# EAGLE design millionOhms (EAGLE 6.1)
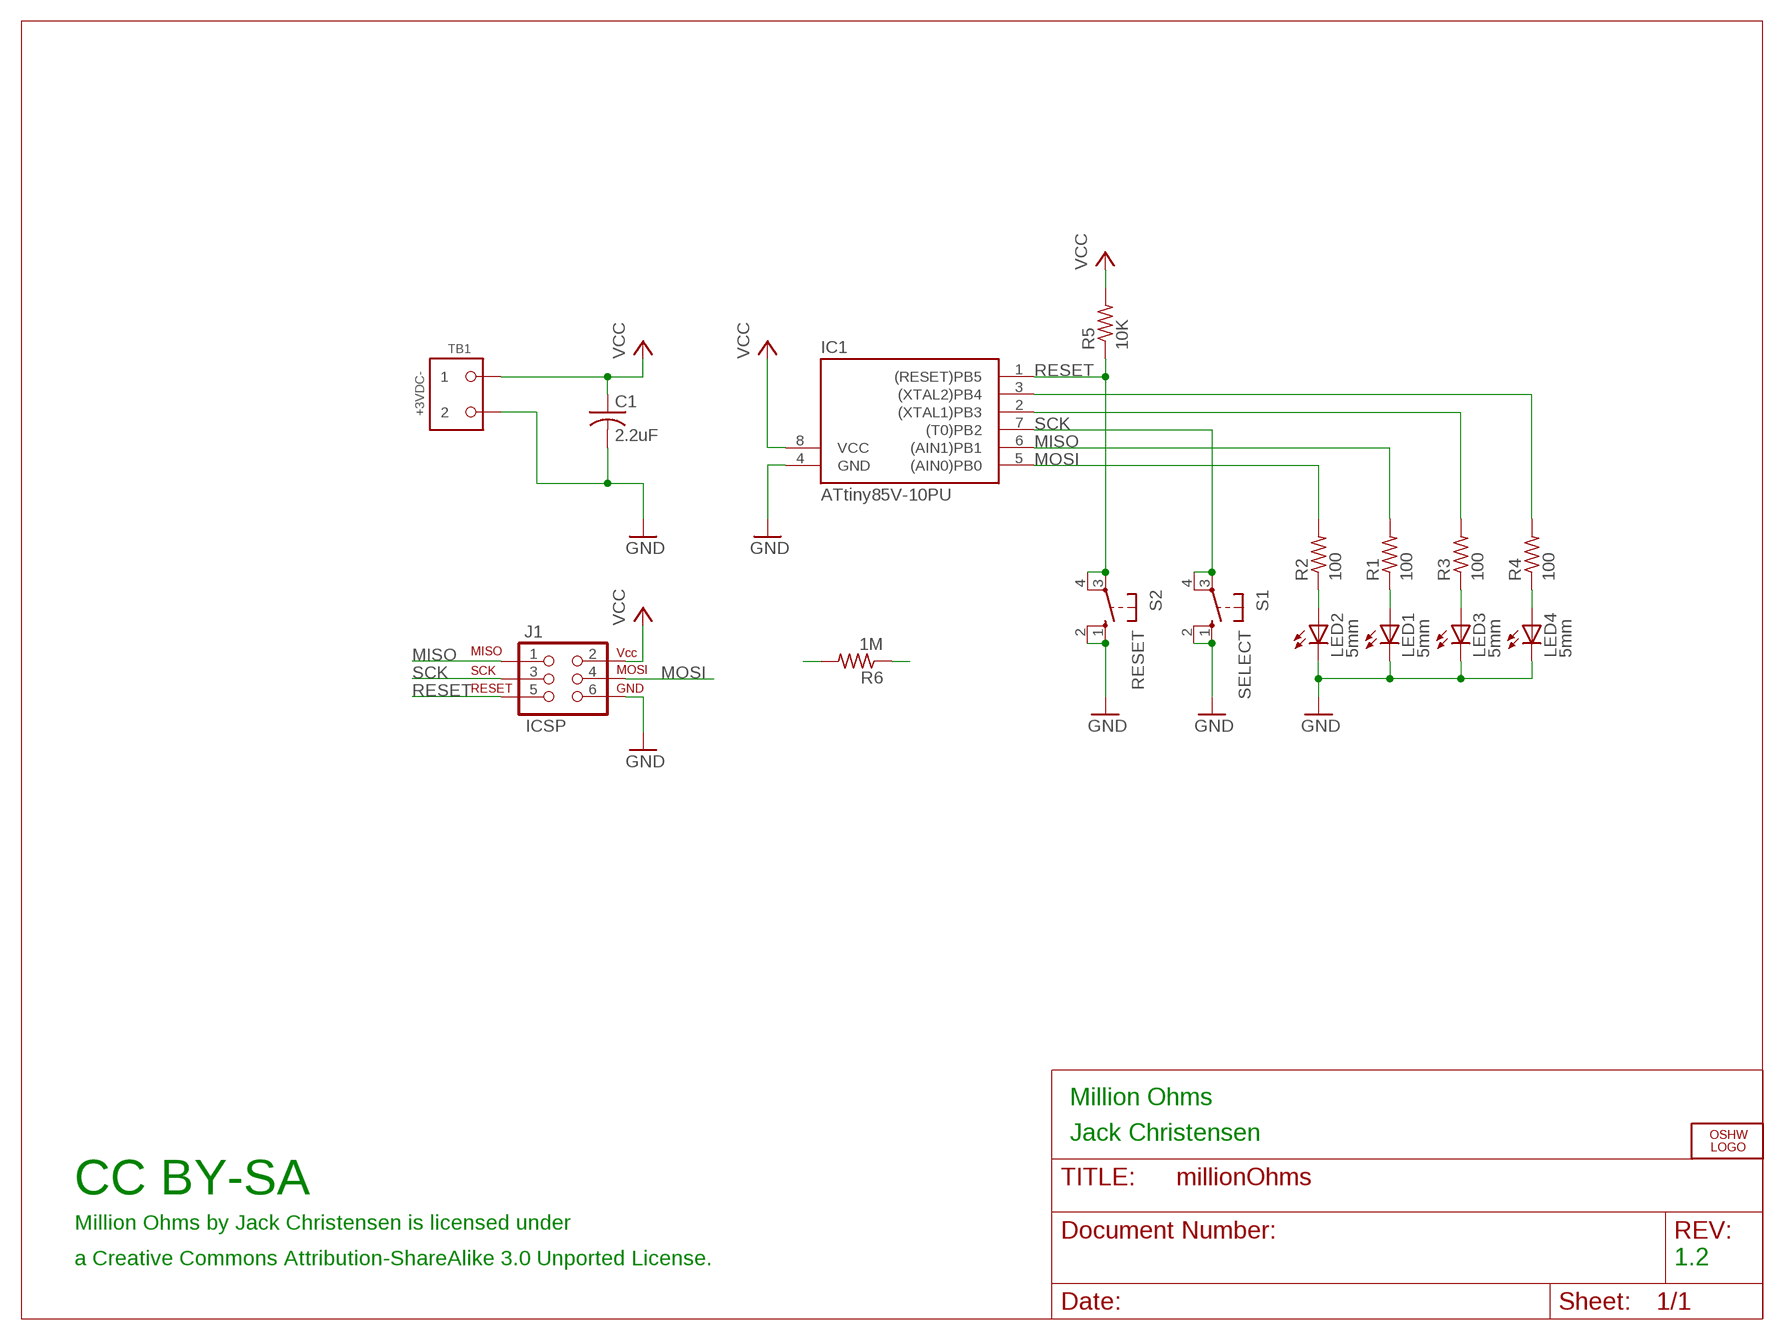
[diagram p0: schematic, sheet 1]

## Parts
C1  2.2uF  C-US025-025X050  [C025-025X050]
IC1  ATtiny85V-10PU  TINY10P  [DIL08]
J1  ICSP  AVR_SPI_PRG_6PTH  [2X3]
LED1  5mm  LED5MM  [LED5MM]
LED2  5mm  LED5MM  [LED5MM]
LED3  5mm  LED5MM  [LED5MM]
LED4  5mm  LED5MM  [LED5MM]
LOGO2  OSHW_LOGO_8MILX0150-NT  [OSHW_8X150_NOTEXT]
R1  100  R-US_0204/6  [0204/6]
R2  100  R-US_0204/6  [0204/6]
R3  100  R-US_0204/6  [0204/6]
R4  100  R-US_0204/6  [0204/6]
R5  10K  R-US_0204/6  [0204/6]
R6  1M  R-US_5616/20  [5616/20]
S1  SELECT  10-XXOCT  [B3F-10XXOCT]
S2  RESET  10-XXOCT  [B3F-10XXOCT]
TB1  +3VDC-  OST-TB-23.5MM  [OST-TB-2-3.5MM]

## Nets
GND: C1.2 IC1.4(GND) J1.6 LED1.K(C) LED2.K(C) LED3.K(C) LED4.K(C) S1.1(S) S1.2(S1) S2.1(S) S2.2(S1) TB1.P$2
MISO: IC1.6((AIN1)PB1) J1.1 R1.2
MOSI: IC1.5((AIN0)PB0) J1.4 R2.2
N$1: LED2.A R2.1
N$2: LED1.A R1.1
N$3: LED3.A R3.1
N$4: LED4.A R4.1
N$5: R6.P$2
N$6: R6.P$1
N$15: IC1.2((XTAL1)PB3) R3.2
N$16: IC1.3((XTAL2)PB4) R4.2
RESET: IC1.1((RESET)PB5) J1.5 R5.1 S2.3(P) S2.4(P1)
SCK: IC1.7((T0)PB2) J1.3 S1.3(P) S1.4(P1)
VCC: C1.1 IC1.8(VCC) J1.2 R5.2 TB1.P$1

## Notes on the sheet
- Million Ohms
- Jack Christensen
- CC BY-SA
- Million Ohms by Jack Christensen is licensed under
- a Creative Commons Attribution-ShareAlike 3.0 Unported License. | 1.2

## Library data of the parts
C1 = _jc:C-US: CAPACITOR, American symbol
IC1 = atmel:TINY10: MICROCONTROLLER 1 Kbytes ROM; OC_FARNELL: unknown; OC_NEWARK: unknown
J1 = _jc:AVR_SPI_PRG_6: AVR ISP 6 Pin This is the reduced ISP connector for AVR programming. Common on Arduino. This footprint will take up less PCB space and can be used with a 10-pin to 6-pin adapter such as SKU: BOB-08508
LED1-LED4 = _jc:LED: LED OSRAM: - CHIPLED LG R971, LG N971, LY N971, LG Q971, LY Q971, LO R971, LY R971 LH N974, LH R974 LS Q976, LO Q976, LY Q976 LO Q996 - Hyper CHIPLED LW Q18S LB Q993, LB Q99A, LB R99A - SideLED LS A670, LO A670, LY A670, LG A670, LP A670 LB A673, LV A673, LT A673, LW A673 LH A674 LY A675 LS A676, LA A676, LO A676, LY A676, LW A676 LS A679, LY A679, LG A679 - Hyper Micro SIDELED® LS Y876, LA Y876, LO Y876, LY Y876 LT Y87S - SmartLED LW L88C, LW L88S LB L89C, LB L89S, LG L890 LS L89K, LO L89K, LY L89K LS L896, LA L896, LO L896, LY L896 - TOPLED LS T670, LO T670, LY T670, LG T670, LP T670 LSG T670, LSP T670, LSY T670, LOP T670, LYG T670 LG T671, LOG T671, LSG T671 LB T673, LV T673, LT T673, LW T673 LH T674 LS T676, LA T676, LO T676, LY T676, LB T676, LH T676, LSB T676, LW T676 LB T67C, LV T67C, LT T67C, LS T67K, LO T67K, LY T67K, LW E67C LS E67B, LA E67B, LO E67B, LY E67B, LB E67C, LV E67C, LT E67C LW T67C LS T679, LY T679, LG T679 LS T770, LO T770, LY T770, LG T770, LP T770 LB T773, LV T773, LT T773, LW T773 LH T774 LS E675, LA E675, LY E675, LS T675 LS T776, LA T776, LO T776, LY T776, LB T776 LHGB T686 LT T68C, LB T68C - Hyper Mini TOPLED® LB M676 - Mini TOPLED Santana® LG M470 LS M47K, LO M47K, LY M47K Source: http://www.osram.convergy.de/
LOGO2 = ohw-logo:OSHW_LOGO_8MIL
R1-R6 = _jc:R-US_: RESISTOR, American symbol
S1 S2 = _jc:10-XX: OMRON SWITCH
TB1 = _jc:OST-TB-2

## Board
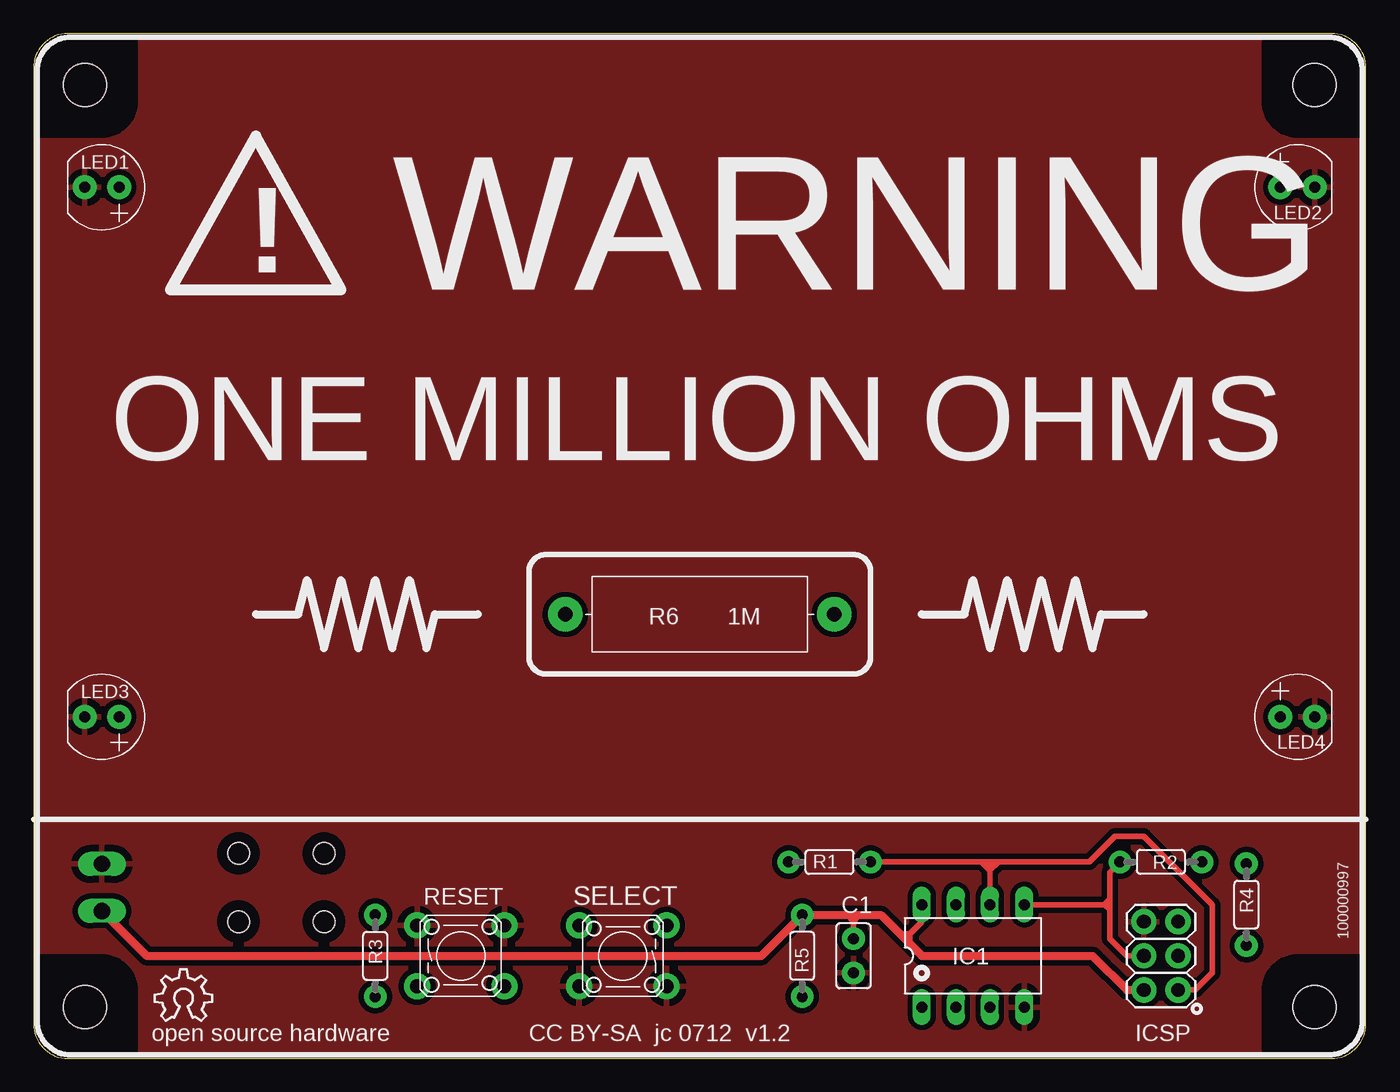
[diagram p1: board, top side]
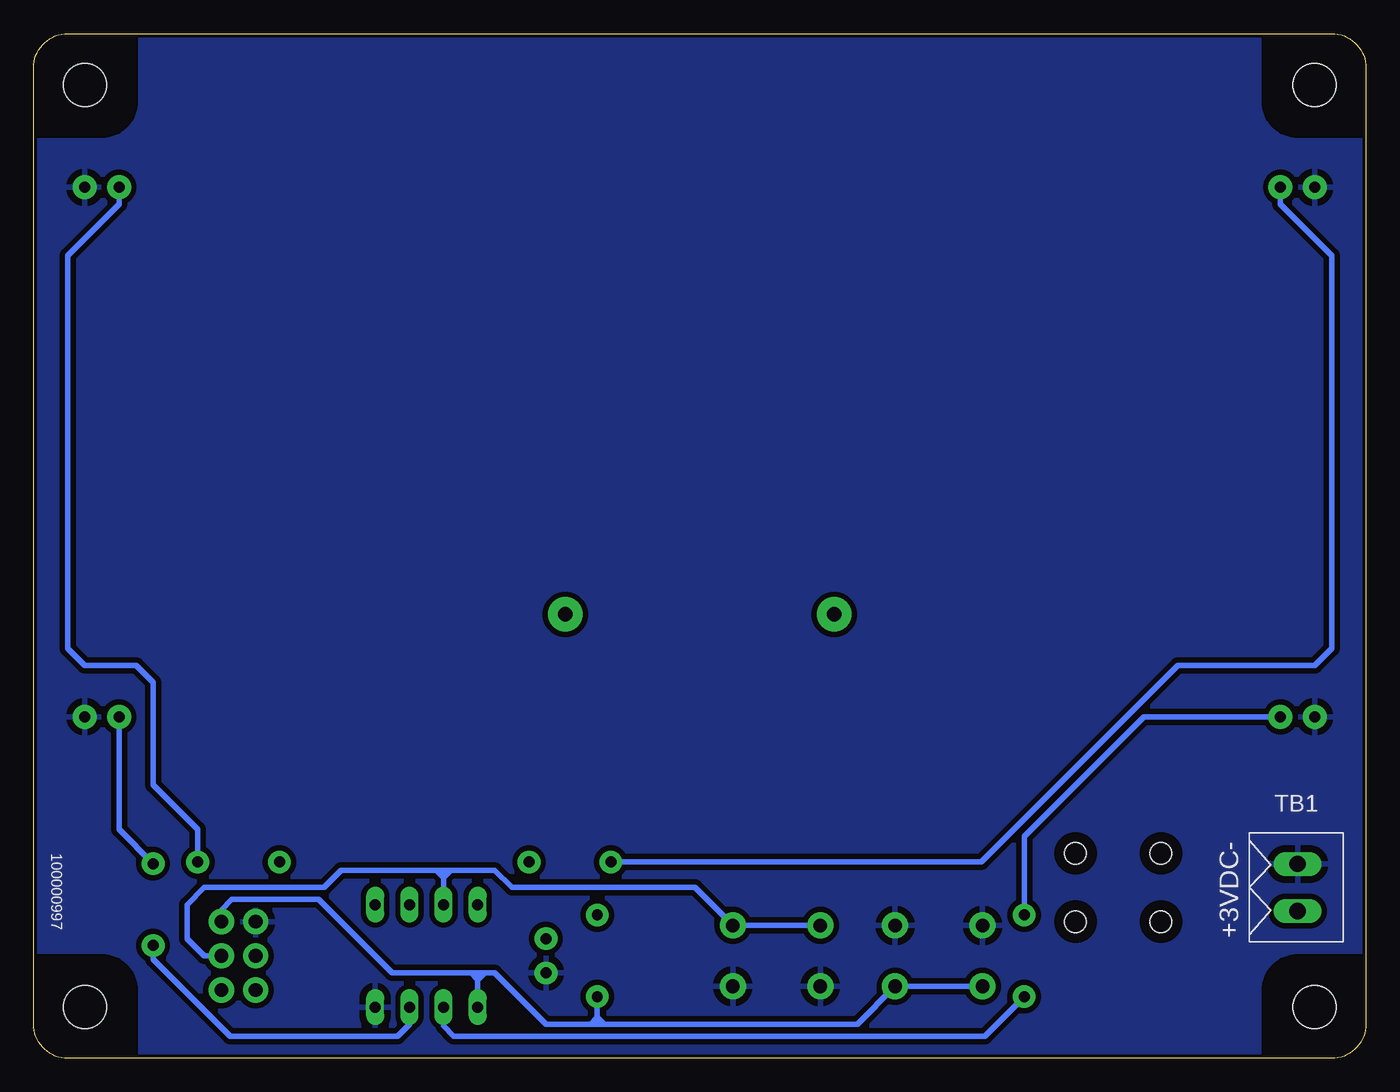
[diagram p2: board, bottom side, seen from below]

Size 99.06 x 76.2 mm. Coordinates in mm from the lower left corner, seen from the top.
Outline: 2.54,76.2 arc90 0,73.66 0,2.54 arc90 2.54,0 96.52,0 arc90 99.06,2.54 99.06,73.66 arc90 96.52,76.2 2.54,76.2
Copper layers (1*16): Top 0.035mm / dielectric 1.5mm / Bottom 0.035mm
Design rules: minimum track width 6mil, minimum drill 12mil, track to track 16mil, track to pad 16mil, pad to pad 16mil, via to via 16mil, smd to smd 0mil, copper to edge 10mil, drill to drill 10mil, minimum pad ring 10mil, minimum via ring 6mil, stop-mask expansion 2mil, vias tented up to drill 100mil, thermal gap 20mil
Holes 3.2 mm at 3.81,72.39 95.25,72.39 3.81,3.81 95.25,3.81
Holes 1.6 mm at 15.24,15.24 15.24,10.16 21.59,10.16 21.59,15.24
tRestrict: area 14,14 to 16.5,16.5; area 20.3,14 to 22.9,16.5; area 20.3,8.9 to 22.9,11.4; area 14,8.9 to 16.5,11.4; area -3.8,68.6 to 7.6,78.7; area 91.4,68.6 to 101.6,78.7; area -3.8,-2.5 to 7.6,7.6; area 91.4,-2.5 to 101.6,7.6
bRestrict: area 14,14 to 16.5,16.5; area 20.3,14 to 22.9,16.5; area 20.3,8.9 to 22.9,11.4; area 14,8.9 to 16.5,11.4; area -3.8,68.6 to 7.6,78.7; area 91.4,68.6 to 101.6,78.7; area 91.4,-2.5 to 101.6,7.6; area -3.8,-2.5 to 7.6,7.6

### Footprints (pad centres in the part's own frame; a part is rotated, then mirrored left to right if it is on the bottom)
C025-025X050 = drill 0.813 pad 1.676: 1 -1.27,0; 2 1.27,0
DIL08 = drill 0.813 long: 1 -3.81,-3.81; 2 -1.27,-3.81; 3 1.27,-3.81; 4 3.81,-3.81; 5 3.81,3.81; 6 1.27,3.81; 7 -1.27,3.81; 8 -3.81,3.81
2X3 = drill 1.016 pad 1.88: 1 0,0; 2 0,2.54; 3 2.54,0; 4 2.54,2.54; 5 5.08,0; 6 5.08,2.54
LED5MM = drill 0.813 pad 1.778: A -1.27,0; K 1.27,0
0204/6 = drill 0.813 pad 1.676: 1 -3.04,0; 2 3.04,0
5616/20 = drill 1.1 pad 2.54: P$1 -10,0; P$2 10,0
B3F-10XXOCT = drill 1.016 pad 1.93: 1 -3.251,2.261; 2 3.251,2.261; 3 -3.251,-2.261; 4 3.251,-2.261
OST-TB-2-3.5MM = drill 1.2 long: P$1 1.75,0; P$2 -1.75,0

### Placement (x,y rotation side)
C1  60.96,7.62 270 top
IC1  69.85,7.62 0 top
J1  85.09,5.08 90 top
LED1  5.08,64.77 180 top
LED2  93.98,64.77 0 top
LED3  5.08,25.4 180 top
LED4  93.98,25.4 0 top
LOGO2  9.02,2.79 0 top
R1  59.18,14.61 0 top
R2  83.82,14.61 180 top
R3  25.4,7.62 270 top
R4  90.17,11.43 270 top
R5  57.15,7.62 90 top
R6  49.53,33.02 0 top
S1  43.81,7.62 180 top
S2  31.75,7.62 0 top
TB1  5.08,12.7 270 bottom

### Tracks (layer width: path | path; a pad name or v marks a point on that pad's centre or on a via)
GND
  pour Bottom: -2.54,77.47 100.33,77.47 100.33,-1.27 -2.54,-1.27
  pour Top: -1.27,77.47 100.33,77.47 100.33,-1.27 -1.27,-1.27
MISO
  Top 0.406: J1.1 86.36,5.08 87.63,6.35 87.63,11.43 82.55,16.51 80.39,16.51 78.49,14.61 71.75,14.61 | 71.75,14.61 71.12,14.61 | 71.12,14.61 70.48,14.61 | 70.48,14.61 R1.2 | IC1.6 71.12,13.97 | 71.12,13.97 71.12,14.61 | 71.12,13.97 71.75,14.61 | 71.12,13.97 70.48,14.61
MOSI
  Top 0.406: J1.4 81.28,7.62 80.01,8.89 80.01,11.05 | 80.01,11.43 80.01,11.05 | 80.01,11.43 80.01,11.81 | 80.01,11.81 80.01,13.84 R2.2 | IC1.5 79.63,11.43 | 79.63,11.43 80.01,11.43 | 79.63,11.43 80.01,11.81 | 79.63,11.43 80.01,11.05
N$1
  Bottom 0.406: R2.1 86.86,17.01 90.17,20.32 90.17,27.94 91.44,29.21 95.25,29.21 96.52,30.48 96.52,59.69 92.71,63.5 LED2.A
N$2
  Bottom 0.406: LED1.A 6.35,63.5 2.54,59.69 2.54,30.48 3.81,29.21 13.97,29.21 28.57,14.61 R1.1
N$3
  Bottom 0.406: R3.1 25.4,16.51 16.51,25.4 LED3.A
N$4
  Bottom 0.406: LED4.A 92.71,17.01 R4.1
N$15
  Bottom 0.406: R3.2 28.33,1.65 67.82,1.65 68.58,2.41 IC1.2
N$16
  Bottom 0.406: IC1.3 71.12,2.54 72.01,1.65 84.45,1.65 90.17,7.37 R4.2
RESET
  Bottom 0.406: 57.15,5.08 R5.1 57.15,3.05 | S2.3 S2.4 37.82,2.54 56.64,2.54 | J1.5 85.09,11.05 84.33,11.81 77.85,11.81 72.39,6.35 66.55,6.35 | 65.53,6.35 64.77,6.35 60.96,2.54 57.66,2.54 | 65.53,6.35 66.04,6.35 | 66.04,6.35 66.55,6.35 | 56.64,2.54 57.15,2.54 | 57.15,2.54 57.66,2.54 | 57.15,2.54 57.15,3.05 | 66.04,6.35 66.04,5.84 | 66.04,5.84 IC1.1 | 66.04,5.84 66.55,6.35 | 66.04,5.84 65.53,6.35 | 57.15,3.05 56.64,2.54 | 57.15,3.05 57.66,2.54
SCK
  Bottom 0.406: S1.4 40.64,10.16 40.92,9.88 S1.3 49.89,12.7 63.5,12.7 64.77,13.97 68.07,13.97 | J1.3 86.36,7.62 87.63,8.89 87.63,11.43 86.36,12.7 77.47,12.7 76.2,13.97 69.09,13.97 | 69.09,13.97 68.58,13.97 | 68.58,13.97 68.07,13.97 | IC1.7 68.58,13.46 | 68.58,13.46 68.58,13.97 | 68.58,13.46 69.09,13.97 | 68.58,13.46 68.07,13.97
VCC
  Top 0.406: 60.96,10.66 60.96,10.16 | 60.96,10.16 C1.1 | IC1.8 66.04,10.16 65.15,9.27 | 64.77,8.89 65.15,9.27 | 65.15,9.27 65.15,8.76 | 65.15,9.27 64.52,9.27 | 60.96,10.16 61.34,10.54 | 60.96,10.16 60.58,10.54
  Top 0.61: 57.02,10.79 R5.2 | R5.2 60.96,10.66 63,10.66 64.77,8.89 66.04,7.62 78.74,7.62 81.28,5.08 J1.2 | TB1.P$1 8.41,7.62 54.11,7.62 R5.2

### Text on the board
tPlace: ! | WARNING | ONE MILLION OHMS
tNames: 100000997 | open source hardware | CC BY-SA jc 0712 v1.2
bNames: 100000997
bDocu: Beware the resistor! | Press SELECT to turn on, or to change | flashing speed and pattern. | Hold SELECT to turn off. | Turns off automatically after five minutes. | Licensed under the Creative Commons | Attribution-ShareAlike 3.0 Unported License. | http://creativecommons.org/licenses/by-sa/3.0/ | J. Christensen Jul-2012 v1.2 | Eagle files and assembly instructions at: | http://github.com/JChristensen/millionOhms_HW | Software at: | http://github.com/JChristensen/millionOhms_SW